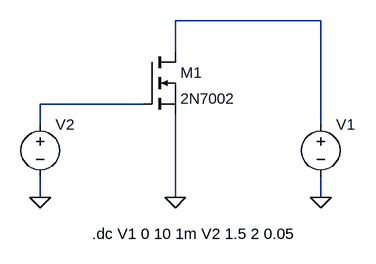
[diagram p0: schematic mosfet-curva-salida.asc]
mosfet-curva-salida.asc, the LTspice schematic file:
Version 4
SHEET 1 880 680
WIRE 512 16 288 16
WIRE 288 64 288 16
WIRE 240 144 80 144
WIRE 80 176 80 144
WIRE 512 176 512 16
WIRE 80 288 80 256
WIRE 288 288 288 160
WIRE 512 288 512 256
FLAG 80 288 0
FLAG 288 288 0
FLAG 512 288 0
SYMBOL voltage 512 160 R0
WINDOW 3 24 44 Left 2
WINDOW 123 0 0 Left 0
WINDOW 39 0 0 Left 0
SYMATTR Value ""
SYMATTR InstName V1
SYMBOL voltage 80 160 R0
WINDOW 3 24 44 Left 2
WINDOW 123 0 0 Left 0
WINDOW 39 0 0 Left 0
SYMATTR Value ""
SYMATTR InstName V2
SYMBOL nmos 240 64 R0
SYMATTR InstName M1
SYMATTR Value 2N7002
TEXT 160 344 Left 2 !.dc V1 0 10 1m V2 1.5 2 0.05

The netlist it stands for:
* mosfet-curva-salida.asc
V1 N001 0
V2 N002 0
M1 N001 N002 0 0 2N7002
.model NMOS NMOS
.model PMOS PMOS
.lib standard.mos
.dc V1 0 10 1m V2 1.5 2 0.05
.backanno
.end